# EasyEDA Pro project Ada - V1 as built.eprj

# Schematic Main Board

## Sheets
1 Daughter Cards: Create Date: 2024-01-18; Page Name: Daughter Cards; Project Name: Ada; Schematic Name: Main Board; Update Date: 2024-08-05; Company: EasyEDA.com; Drawed: EasyEDA Pro; Page Size: A4; Part Number: JLCPCB-002; Reviewed: EasyEDA Pro; Version: V0.1
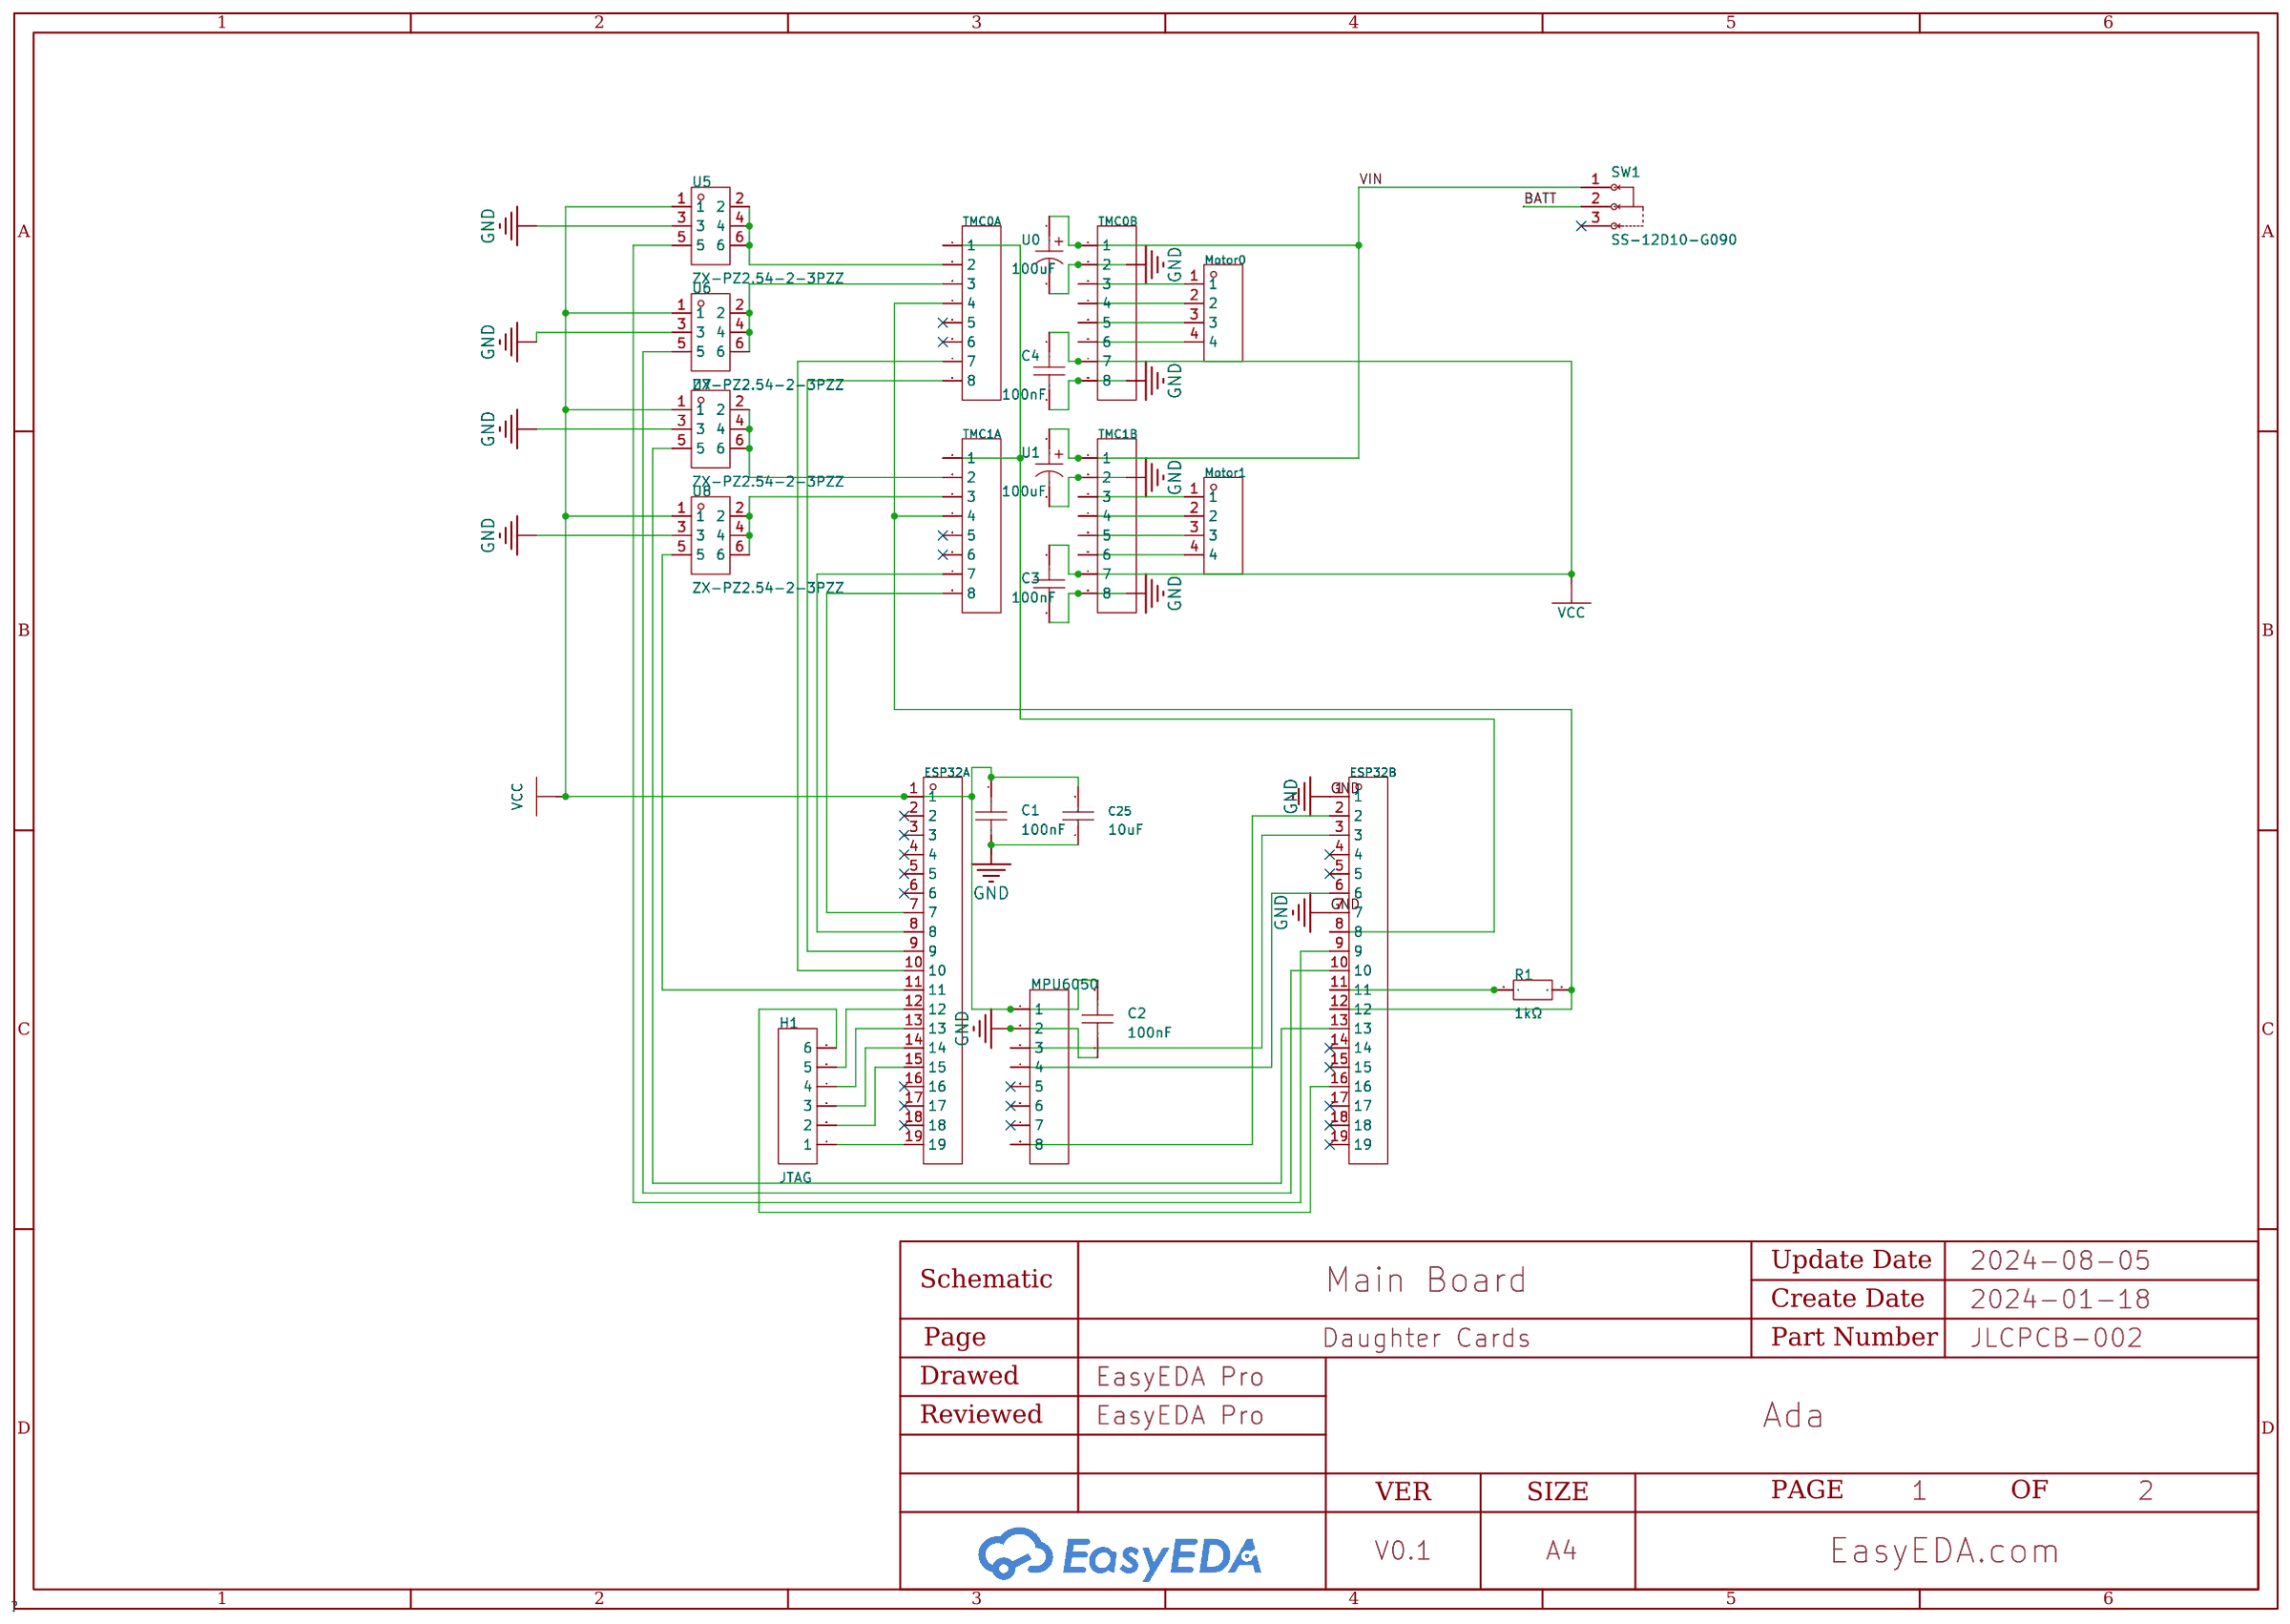
[diagram p0: Daughter Cards]
2 Power Circuit: Create Date: 2024-07-30; Page Name: Power Circuit
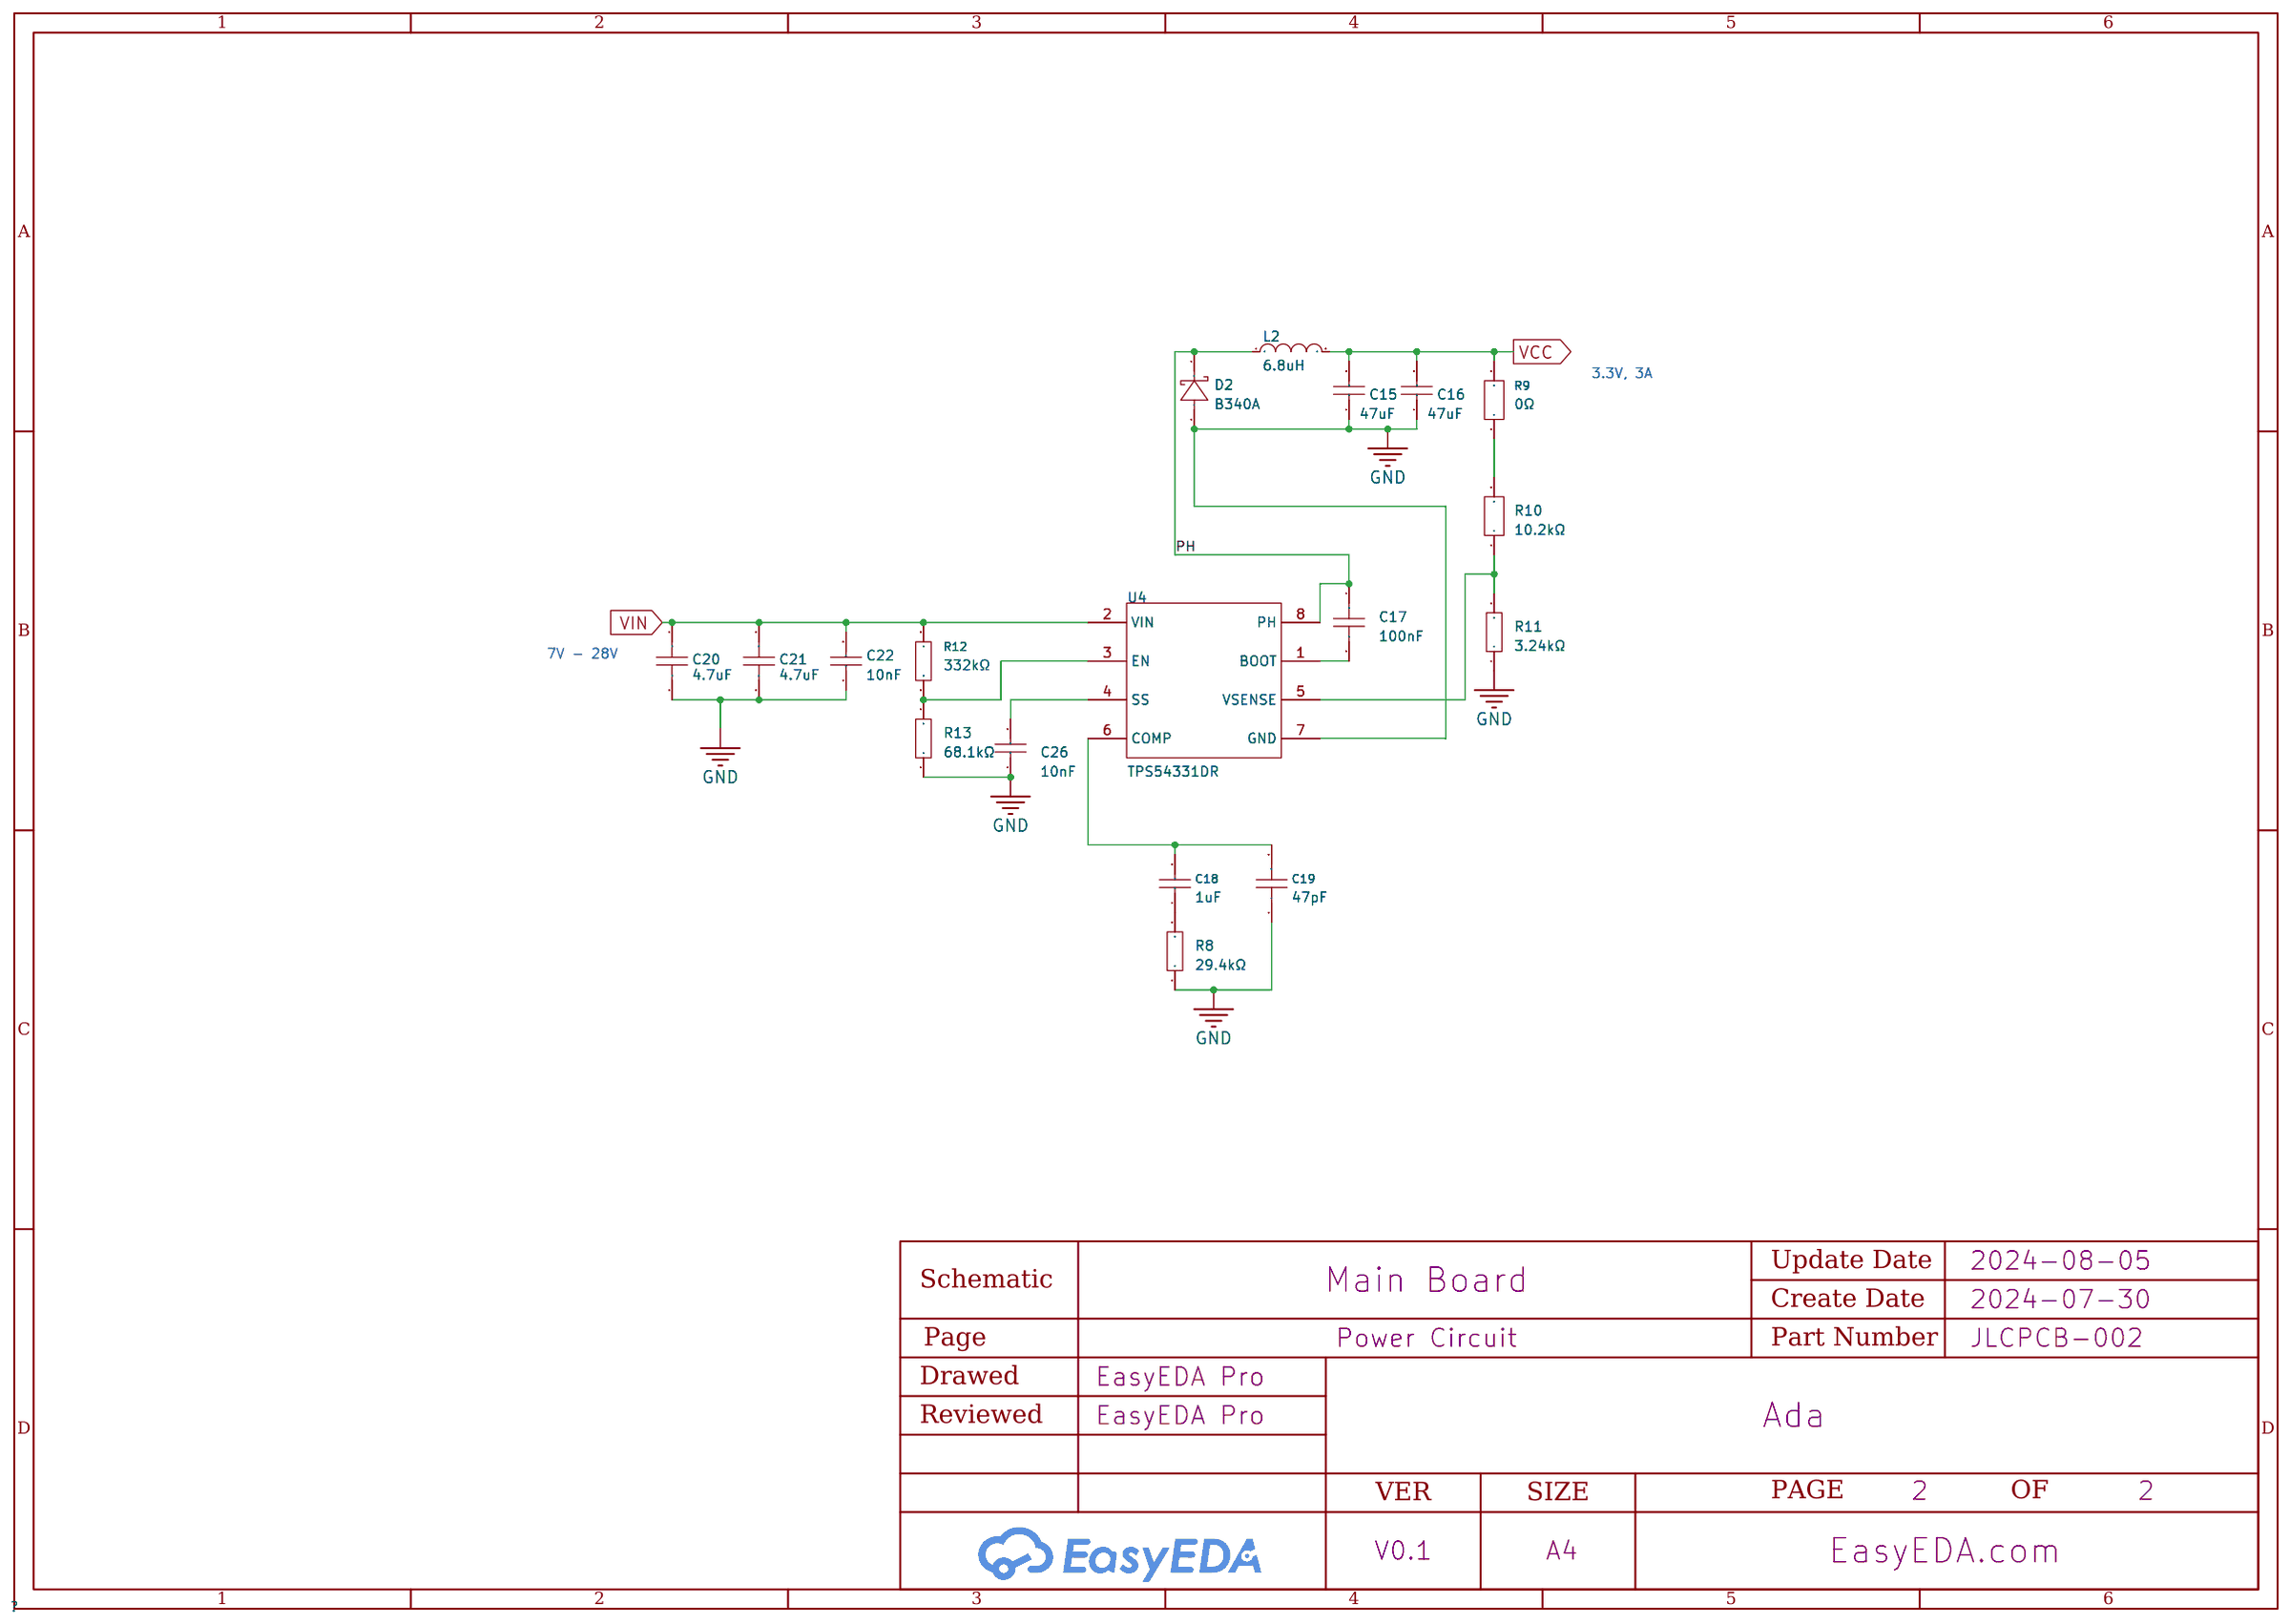
[diagram p1: Power Circuit]

## Parts
sheet Daughter Cards
C1  100nF  [C0201]
C2  100nF  [C0201]
C3  100nF  [C0201]
C4  100nF  [C0201]
C25  10uF  [C0402]
ESP32A  ESP32  [HDR-TH_19P-P2.54-V-F]
ESP32B  2.54-1*19P母  [HDR-TH_19P-P2.54-V-F]
H1  JTAG  [HDR-TH_6P-P2.54-V-M-1]
Motor0  Motor 0  [HDR-TH_4P-P2.54-V-M]
Motor1  Motor 1  [HDR-TH_4P-P2.54-V-M]
MPU6050  MPU6050  [HDR-TH_8P-P2.54-V-F-1]
R1  1kΩ  [R0603]
SW1  SS-12D10-G090  [SW-TH_3P-L12.7-W6.6-P4.70_C9900034369]
TMC0A  TMC0A  [HDR-TH_8P-P2.54-V-F-1]
TMC0B  2.54-1*8P母环保  [HDR-TH_8P-P2.54-V-F-1]
TMC1A  TMC2209  [HDR-TH_8P-P2.54-V-F-1]
TMC1B  2.54-1*8P母环保  [HDR-TH_8P-P2.54-V-F-1]
U0  100uF  [CAP-TH_BD6.3-P2.50-D0.5-FD]
U1  100uF  [CAP-TH_BD6.3-P2.50-D0.5-FD]
U5  ZX-PZ2.54-2-3PZZ  [HDR-TH_6P-P2.54-V-M-R2-C3-S2.54-1]
U6  ZX-PZ2.54-2-3PZZ  [HDR-TH_6P-P2.54-V-M-R2-C3-S2.54-1]
U7  ZX-PZ2.54-2-3PZZ  [HDR-TH_6P-P2.54-V-M-R2-C3-S2.54-1]
U8  ZX-PZ2.54-2-3PZZ  [HDR-TH_6P-P2.54-V-M-R2-C3-S2.54-1]
sheet Power Circuit
C15  47uF  [C0805]
C16  47uF  [C0805]
C17  100nF  [C0201]
C18  1uF  [C0402]
C19  47pF  [C0603]
C20  4.7uF  [C0603]
C21  4.7uF  [C0603]
C22  10nF  [C0603]
C26  10nF  [C0201]
D2  B340A  [SMA_L4.3-W2.6-LS5.0-RD]
L2  6.8uH  [IND-SMD_L5.2-W5.2_MS0530-XX]
R8  29.4kΩ  [R0201]
R9  0Ω  [R0201]
R10  10.2kΩ  [R0201]
R11  3.24kΩ  [R0603]
R12  332kΩ  [R0402]
R13  68.1kΩ  [R0402]
U4  TPS54331DR  [SOIC-8_L5.0-W4.0-P1.27-LS6.0-BL]

## Library data of the parts
C1-C4 C17 = CL03A104KQ3NNNC: Capacitance: Tolerance:±10% Tolerance:±10% Voltage Rated: Temperature Coefficient:; LCSC Part Name: 100nF ±10% 6.3V; Supplier Part: C160831; Manufacturer: SAMSUNG(三星); Supplier Footprint: 0201; Datasheet: https://atta.szlcsc.com/upload/public/pdf/source/20171228/C163510_15144412327381213809.pdf; Supplier: LCSC; Tolerance: ±10%
C25 = CL05A106MQ5NUNC: Capacitance: Tolerance:±20% Tolerance:±20% Voltage Rated: Temperature Coefficient:; LCSC Part Name: 10uF ±20% 6.3V; Supplier Part: C15525; Manufacturer: SAMSUNG(三星); Supplier Footprint: 0402; Datasheet: https://atta.szlcsc.com/upload/public/pdf/source/20220823/2B02EE04F8F211D38A52DCB16EB6BEBA.pdf; Supplier: LCSC; Tolerance: ±20%
ESP32A ESP32B = 2.54-1*19P母: Pitch:2.54mm Row Spacing:- Mounting Type:Straight Number of Rows:Plugin Number of Holes:19P Insulation Height:- Contact Material:- Contact Plating:-; LCSC Part Name: 间距:2.54mm 直插; Supplier Part: C319202; Manufacturer: BOOMELE(博穆精密); Supplier Footprint: 插件,P=2.54mm; JLCPCB Part Class: Extended Part; Supplier: LCSC; Pitch: 2.54mm; Mounting Type: Straight; Number of Rows: Plugin; Number of Holes: 19P
H1 = 2.54-1x6P直针: Pin Structure:1x6P Pitch:2.54mm Row Spacing:- Circluar Pins/Square Pins:Square Pins Mounting Type:Straight Number of Rows:Plugin Number of Pins:6P Current Rating (Max):3A Voltage Rating (Max):- Length of Mating Pin:- Insulation Height:- Contact Material:; LCSC Part Name: 间距:2.54mm 1x6P 直插 方针; Supplier Part: C37208; Manufacturer: BOOMELE(博穆精密); Supplier Footprint: 插件,P=2.54mm; JLCPCB Part Class: Extended Part; Supplier: LCSC; Pin Structure: 1x6P; Pitch: 2.54mm; Circluar Pins/Square Pins: Square Pins; Mounting Type: Straight; Number of Rows: Plugin; Number of Pins: 6P; Current Rating (Max): 3A; Operating Temperature Range: -40℃~+105℃; Color: Black
Motor0 Motor1 = PZ254V-11-04P: Pin Structure:1x4P Pitch:2.54mm Row Spacing:- Circluar Pins/Square Pins:Square Pins Mounting Type:Straight Number of Rows:Plugin Number of Pins:4P Current Rating (Max):3A Voltage Rating (Max):250V Length of Mating Pin:6mm Insulation Height:2.5mm Length of; LCSC Part Name: 间距:2.54mm 1x4P 直插 方针; Supplier Part: C2691448; Manufacturer: XFCN(兴飞); Supplier Footprint: 插件,P=2.54mm; JLCPCB Part Class: Extended Part; Datasheet: https://atta.szlcsc.com/upload/public/pdf/source/20200309/C492403_F9F19131791D08044AD4F84F8E751A34.pdf; Supplier: LCSC; Pin Structure: 1x4P; Pitch: 2.54mm; Circluar Pins/Square Pins: Square Pins; Mounting Type: Straight; Number of Rows: Plugin; Number of Pins: 4P; Current Rating (Max): 3A; Voltage Rating (Max): 250V; Length of Mating Pin: 6mm; Insulation Height: 2.5mm; Length of End Connection Pin: 3mm; Operating Temperature Range: -40℃~+105℃; Color: Black
MPU6050 TMC0A TMC0B TMC1A TMC1B = 2.54-1*8P母环保: Holes Structure:1x8P Pitch:2.54mm Row Spacing:- Mounting Type:Straight Number of Rows:Plugin Number of Holes:8P Insulation Height:- Contact Material:- Contact Plating:-; LCSC Part Name: 间距:2.54mm 1x8P 直插; Supplier Part: C27438; Manufacturer: BOOMELE(博穆精密); Supplier Footprint: 插件,P=2.54mm; JLCPCB Part Class: Extended Part; Datasheet: https://atta.szlcsc.com/upload/public/pdf/source/20231221/1CA800C6799ED97958773716FAA1BFFE.pdf; Supplier: LCSC; Holes Structure: 1x8P; Pitch: 2.54mm; Mounting Type: Straight; Number of Rows: Plugin; Number of Holes: 8P
R1 = FCR0603F1K: Type:Thick Film Resistors Resistance: Tolerance:±1% Tolerance:±1% Power(Watts): Overload Voltage (Max): Operating Temperature Range:-55℃~+155℃ Operating Temperature Range:-55℃~+155℃; LCSC Part Name: 1K ±1%; Supplier Part: C5913168; Manufacturer: VO(翔胜); Supplier Footprint: 0603; Datasheet: https://atta.szlcsc.com/upload/public/pdf/source/20230428/98B65D379E9BA4CF2A9223D1647B01B6.pdf; Supplier: LCSC; Type: Thick Film Resistors; Tolerance: ±1%; Operating Temperature Range: -55℃~+155℃
SW1 = SS-12D10-G090: Circuit:SPDT Pin Style:PCPin Switch Length:12.7mm Switch Width:6.6mm Switch Height:13.4mm Mounting Style:Straight Actuator Color:Black Current Rating (DC):5A Voltage Rating (DC):24V Current Rating (AC):- Voltage Rating (AC):- Mechanical Life:1万次 Operating; LCSC Part Name: 5A大电流拨动开关 G9柄; Supplier Part: C5155552; Manufacturer: G-Switch(品赞); Supplier Footprint: 插件; Datasheet: https://atta.szlcsc.com/upload/public/pdf/source/20240530/FB6A27340729D0C5B76E7AC8CC1F32D2.pdf; Supplier: LCSC; Circuit: SPDT; Pin Style: PCPin; Switch Length: 12.7mm; Switch Width: 6.6mm; Switch Height: 13.4mm; Mounting Style: Straight; Actuator Color: Black; Current Rating (DC): 5A; Voltage Rating (DC): 24V; Mechanical Life: 1万次; Operating Temperature: -25℃~+70℃
U0 U1 = 03EC0728: Capacitance: Tolerance:±20% Tolerance:±20% Rated Voltage: Ripple Current:140mA@120kHz Equivalent Series Resistance(ESR):- Lead Spacing: φD: L: Lifetime @ Temp:2000hrs@105℃ Operating Temperature:-40℃~+105℃ Operating Temperature:-40℃~+105℃; LCSC Part Name: 100uF ±20% 25V; Supplier Part: C2831782; Manufacturer: KNSCHA(科尼盛); Supplier Footprint: 插件,D6.3xL12mm; Datasheet: https://atta.szlcsc.com/upload/public/pdf/source/20210511/C2831782_5BCB0B9CD26517435D205DF95E3C4F67.pdf; Supplier: LCSC; Tolerance: ±20%; Ripple Current: 140mA@120kHz; Lifetime @ Temp: 2000hrs@105℃; Operating Temperature: -40℃~+105℃
U5-U8 = ZX-PZ2.54-2-3PZZ: Pin Structure:2x3P Pitch:2.54mm Row Spacing:2.54mm Circluar Pins/Square Pins:Square Pins Mounting Type:Straight Number of Rows:双排 Number of Pins:6P Current Rating (Max):3A Voltage Rating (Max):1kV Length of Mating Pin:6mm Insulation Height:2.5mm Length of; LCSC Part Name: 2x3P 间距:2.54mm 方针 直插; Supplier Part: C7501274; Manufacturer: Megastar(兆星); Supplier Footprint: 插件,P=2.54mm; Datasheet: https://atta.szlcsc.com/upload/public/pdf/source/20231122/E8390501A702A71E626C593F036B3607.pdf; Supplier: LCSC; Pin Structure: 2x3P; Pitch: 2.54mm; Row Spacing: 2.54mm; Circluar Pins/Square Pins: Square Pins; Mounting Type: Straight; Number of Rows: 双排; Number of Pins: 6P; Current Rating (Max): 3A; Voltage Rating (Max): 1kV; Length of Mating Pin: 6mm; Insulation Height: 2.5mm; Length of End Connection Pin: 3mm; Contact Plating: Gold; Operating Temperature Range: -40℃~+105℃; Color: Black
C15 C16 = CL21A476MQYNNNE: Capacitance: Tolerance:±20% Tolerance:±20% Voltage Rated: Temperature Coefficient:; LCSC Part Name: 47uF ±20% 6.3V; Supplier Part: C16780; Manufacturer: SAMSUNG(三星); Supplier Footprint: 0805; Datasheet: https://atta.szlcsc.com/upload/public/pdf/source/20160218/1457707763339.pdf; Supplier: LCSC; Tolerance: ±20%
C18 = CL05A105KQ5NNNC: Capacitance: Tolerance:±10% Tolerance:±10% Voltage Rated: Temperature Coefficient:; LCSC Part Name: 1uF ±10% 6.3V; Supplier Part: C107372; Manufacturer: SAMSUNG(三星); Supplier Footprint: 0402; Datasheet: https://atta.szlcsc.com/upload/public/pdf/source/20160218/1457707763339.pdf; Supplier: LCSC; Tolerance: ±10%
C19 = CC0603JRNPO8BN470: Capacitance: Tolerance:±5% Tolerance:±5% Voltage Rated: Temperature Coefficient:; LCSC Part Name: 47pF ±5% 25V; Supplier Part: C519392; Manufacturer: YAGEO(国巨); Supplier Footprint: 0603; Datasheet: https://atta.szlcsc.com/upload/public/pdf/source/20200423/C519392_865C256CEF0C45ADD797D116E7ADE01D.pdf; Supplier: LCSC; Tolerance: ±5%
C20 C21 = CL10A475KL8NRNC: Capacitance: Tolerance:±10% Tolerance:±10% Voltage Rated: Temperature Coefficient:; LCSC Part Name: 4.7uF ±10% 35V; Supplier Part: C307467; Manufacturer: SAMSUNG(三星); Supplier Footprint: 0603; JLCPCB Part Class: Extended Part; Datasheet: https://atta.szlcsc.com/upload/public/pdf/source/20160218/1457707763339.pdf; Supplier: LCSC; Tolerance: ±10%
C22 = CL10B103KB8NNNC: Capacitance: Tolerance:±10% Tolerance:±10% Voltage Rated: Temperature Coefficient:; LCSC Part Name: 10nF ±10% 50V; Supplier Part: C1589; Manufacturer: SAMSUNG(三星); Supplier Footprint: 0603; JLCPCB Part Class: Extended Part; Datasheet: https://atta.szlcsc.com/upload/public/pdf/source/20160218/1457707763339.pdf; Supplier: LCSC; Tolerance: ±10%
C26 = GRM033R70J103KA01D: Capacitance: Tolerance:±10% Tolerance:±10% Voltage Rated: Temperature Coefficient:; LCSC Part Name: 10nF ±10% 6.3V; Supplier Part: C76940; Manufacturer: muRata(村田); Supplier Footprint: 0201; Datasheet: https://atta.szlcsc.com/upload/public/pdf/source/20180307/C76940_15204091030811407728.pdf; Supplier: LCSC; Tolerance: ±10%
D2 = B340A_C3018525: Forward Voltage (Vf@If):550mV@3A Reverse Voltage (Vr):40V Average Rectified Current (Io):3A Reverse Leakage Current (Ir):500uA@40V; LCSC Part Name: 电压:40V 电流:3A; Supplier Part: C3018525; Manufacturer: FUXINSEMI(富芯森美); Supplier Footprint: SMA(DO-214AC); Datasheet: https://atta.szlcsc.com/upload/public/pdf/source/20220530/48889337C27311960E6F9D350CFD44EF.pdf; Supplier: LCSC; Forward Voltage (Vf@If): 550mV@3A; Reverse Voltage (Vr): 40V; Average Rectified Current (Io): 3A; Reverse Leakage Current (Ir): 500uA@40V
L2 = MDA5030-6R8M: Inductance: Tolerance:±20% Tolerance:±20% Rated Current: Saturation Current (Isat): DC Resistance (DCR):; LCSC Part Name: 6.8uH ±20% 3.5A; Supplier Part: C2847478; Manufacturer: KOHERelec(科或); Supplier Footprint: SMD,5.2x5.7mm; Datasheet: https://atta.szlcsc.com/upload/public/pdf/source/20210806/C2847475_BCA7949AA3147D213A746F6BA524684A.pdf; Supplier: LCSC; Tolerance: ±20%
R8 = RC-01W2942FT: Type:Thick Film Resistors Resistance:29.4kΩ Tolerance:±1% Tolerance:±1% Power(Watts): Overload Voltage (Max): Temperature Coefficient:±200ppm/℃ Temperature Coefficient:±200ppm/℃ Operating Temperature Range:-55℃~+125℃ Operating Temperature Range:-55℃~+125℃; LCSC Part Name: 厚膜电阻 29.4kΩ ±1% 50mW; Supplier Part: C320810; Manufacturer: FH(风华); Supplier Footprint: 0201; Datasheet: https://atta.szlcsc.com/upload/public/pdf/source/20190117/C304933_DE23167EE8A6EA4261B120B384E5FCE3.pdf; Supplier: LCSC; Type: Thick Film Resistors; Tolerance: ±1%; Temperature Coefficient: ±200ppm/℃; Operating Temperature Range: -55℃~+125℃
R9 = 0201WMF0000TEE: Type:Thick Film Resistors Resistance: Tolerance:±1% Tolerance:±1% Power(Watts): Overload Voltage (Max): Operating Temperature Range:-55℃~+155℃ Operating Temperature Range:-55℃~+155℃; LCSC Part Name: 0Ω ±1% 50mW 厚膜电阻; Supplier Part: C473473; Manufacturer: UNI-ROYAL(厚声); Supplier Footprint: 0201; Datasheet: https://atta.szlcsc.com/upload/public/pdf/source/20200306/C422600_1E6D84923E4A46A82E41ADD87F860B5C.pdf; Supplier: LCSC; Type: Thick Film Resistors; Tolerance: ±1%; Operating Temperature Range: -55℃~+155℃
R10 = RTT011022FTH: Type:Thick Film Resistors Resistance: Tolerance:±1% Tolerance:±1% Power(Watts): Overload Voltage (Max): Temperature Coefficient:±200ppm/℃ Temperature Coefficient:±200ppm/℃ Operating Temperature Range:-55℃~+125℃ Operating Temperature Range:-55℃~+125℃; LCSC Part Name: 厚膜电阻 10.2kΩ ±1% 50mW; Supplier Part: C166388; Manufacturer: RALEC(旺诠); Supplier Footprint: 0201; Datasheet: https://atta.szlcsc.com/upload/public/pdf/source/20180928/C303758_52AE496EA05AD4D633595C32F5A0EBAF.pdf; Supplier: LCSC; Type: Thick Film Resistors; Tolerance: ±1%; Temperature Coefficient: ±200ppm/℃; Operating Temperature Range: -55℃~+125℃
R11 = 0603WAF3241T5E: Type:Thick Film Resistors Resistance:3.24kΩ Tolerance:±1% Tolerance:±1% Power(Watts): Overload Voltage (Max): Temperature Coefficient:±100ppm/℃ Temperature Coefficient:±100ppm/℃ Operating Temperature Range:-55℃~+155℃ Operating Temperature Range:-55℃~+155℃; LCSC Part Name: 3.24kΩ ±1% 100mW 厚膜电阻; Supplier Part: C22994; Manufacturer: UNI-ROYAL(厚声); Supplier Footprint: 0603; Datasheet: https://atta.szlcsc.com/upload/public/pdf/source/20200306/C422600_1E6D84923E4A46A82E41ADD87F860B5C.pdf; Supplier: LCSC; Type: Thick Film Resistors; Tolerance: ±1%; Temperature Coefficient: ±100ppm/℃; Operating Temperature Range: -55℃~+155℃
R12 = 0402WGF3323TCE: Type:Thick Film Resistors Resistance:332kΩ Tolerance:±1% Tolerance:±1% Power(Watts): Overload Voltage (Max): Temperature Coefficient:±100ppm/℃ Temperature Coefficient:±100ppm/℃ Operating Temperature Range:-55℃~+155℃ Operating Temperature Range:-55℃~+155℃; LCSC Part Name: 332kΩ ±1% 62.5mW 厚膜电阻; Supplier Part: C44358; Manufacturer: UNI-ROYAL(厚声); Supplier Footprint: 0402; JLCPCB Part Class: Extended Part; Datasheet: https://atta.szlcsc.com/upload/public/pdf/source/20200306/C422600_1E6D84923E4A46A82E41ADD87F860B5C.pdf; Supplier: LCSC; Type: Thick Film Resistors; Tolerance: ±1%; Temperature Coefficient: ±100ppm/℃; Operating Temperature Range: -55℃~+155℃
R13 = AC0402FR-0768K1L: Type:Thick Film Resistors Resistance: Tolerance:±1% Tolerance:±1% Power(Watts): Overload Voltage (Max): Temperature Coefficient:±100ppm/℃ Temperature Coefficient:±100ppm/℃ Operating Temperature Range:-55℃~+155℃ Operating Temperature Range:-55℃~+155℃; LCSC Part Name: 厚膜电阻 68.1kΩ ±1% 62.5mW; Supplier Part: C227190; Manufacturer: YAGEO(国巨); Supplier Footprint: 0402; JLCPCB Part Class: Extended Part; Datasheet: https://atta.szlcsc.com/upload/public/pdf/source/20180927/C229861_4ABDC471507C1ED6AFB4BA66AFC8620A.pdf; Supplier: LCSC; Type: Thick Film Resistors; Tolerance: ±1%; Temperature Coefficient: ±100ppm/℃; Operating Temperature Range: -55℃~+155℃
U4 = TPS54331DR: Function:Step-down type Output Type:Adjustable Input Voltage:3.5V~28V Input Voltage:3.5V~28V Output Voltage:800mV~25V Output Voltage:800mV~25V Output Current (Max):3A Switching Frequency:570kHz Operating Temperature:-40℃~+150℃@(TJ) Operating Temperature:-; Supplier Part: C9865; Manufacturer: TI(德州仪器); Supplier Footprint: SOIC-8; Datasheet: https://www.ti.com/cn/lit/gpn/tps54331; Supplier: LCSC; Function: Step-down type; Output Type: Adjustable; Input Voltage: 3.5V~28V; Output Voltage: 800mV~25V; Output Current (Max): 3A; Switching Frequency: 570kHz; Operating Temperature: -40℃~+150℃@(TJ); Synchronous Rectification: NO; Number of Outputs: 1; Topology: Step-down; Switch tube (built-in/external): 内置

## Nets
GND: C1.2 C2.2 C3.2 C4.2 C15.1 C16.1 C19.1 C20.2 C21.2 C22.1 C25.1 C26.1 D2.2(A) ESP32B.1 ESP32B.7 MPU6050.2 R8.1 R11.1 R13.1 TMC0B.2 TMC0B.8 TMC1B.2 TMC1B.8 U0.2 U1.2 U4.7(GND) U5.3 U6.3 U7.3 U8.3
VCC: C1.1 C2.1 C3.1 C4.1 C15.2 C16.2 C25.2 ESP32A.1 L2.2 MPU6050.1 R9.2 TMC0B.7 TMC1B.7 U5.1 U6.1 U7.1 U8.1
VIN: C20.1 C21.1 C22.2 R12.2 SW1.1 TMC0B.1 TMC1B.1 U0.1 U1.1 U4.2(VIN)
BATT: SW1.2
PH: C17.1 D2.1(K) L2.1 U4.8(PH)
$1N2122: ESP32B.8 TMC0A.1 TMC1A.1
$1N2154: Motor1.1 TMC1B.3
$1N2157: Motor1.2 TMC1B.4
$1N2160: Motor1.3 TMC1B.5
$1N2163: Motor1.4 TMC1B.6
$1N2166: Motor0.1 TMC0B.3
$1N2169: Motor0.2 TMC0B.4
$1N2172: Motor0.3 TMC0B.5
$1N2175: Motor0.4 TMC0B.6
$1N2308: ESP32A.7 TMC1A.8
$1N2313: ESP32A.8 TMC1A.7
$1N2318: ESP32A.9 TMC0A.8
$1N2328: ESP32A.10 TMC0A.7
$1N2522: ESP32B.11 R1.1
$1N2539: ESP32B.12 R1.2 TMC0A.4 TMC1A.4
$1N9917: TMC0A.2 U5.2 U5.4 U5.6
$1N9931: TMC0A.3 U6.2 U6.4 U6.6
$1N9989: TMC1A.2 U7.2 U7.4 U7.6
$1N10004: TMC1A.3 U8.2 U8.4 U8.6
$1N11023: ESP32A.19 H1.1
$1N11068: ESP32A.13 H1.4
$1N11073: ESP32A.14 H1.3
$1N11078: ESP32A.15 H1.2
$1N15354: ESP32A.11 U8.5
$1N15455: ESP32B.13 U7.5
$1N15484: ESP32A.12 H1.5
$1N15612: ESP32B.16 H1.6
$1N15620: ESP32B.9 U5.5
$1N15633: ESP32B.10 U6.5
$2N758: C26.2 U4.4(SS)
$2N763: C17.2 U4.1(BOOT)
$2N764: C18.2 C19.2 U4.6(COMP)
$2N769: R12.1 R13.2 U4.3(EN)
$2N774: C18.1 R8.2
$2N775: R9.1 R10.2
$2N777: R10.1 R11.2 U4.5(VSENSE)
Net-(ESP32B-2): ESP32B.2 MPU6050.8
Net-(ESP32B-3): ESP32B.3 MPU6050.3
Net-(ESP32B-6): ESP32B.6 MPU6050.4

Not connected (* = marked no-connect by the designer): ESP32A 2* 3* 4* 5* 6* 16* 17* 18*; ESP32B 4* 5* 14* 15* 17* 18* 19*; MPU6050 5* 6* 7*; SW1 3*; TMC0A 5* 6*; TMC1A 5* 6*

## Notes on the sheets
sheet 2
- 3.3V, 3A
- 7V - 28V

# Board PCB1
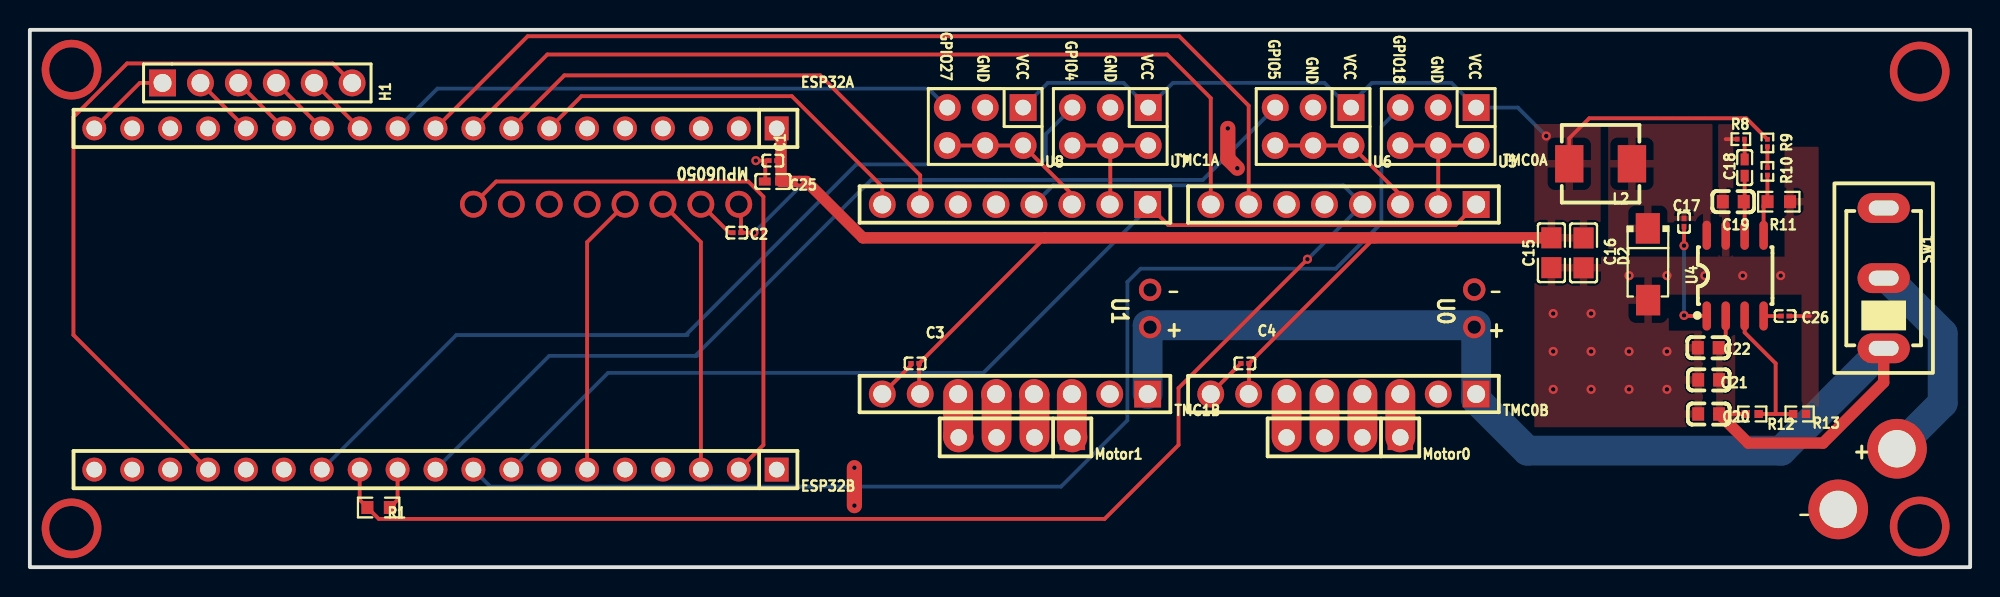
[diagram p2: board, top side]
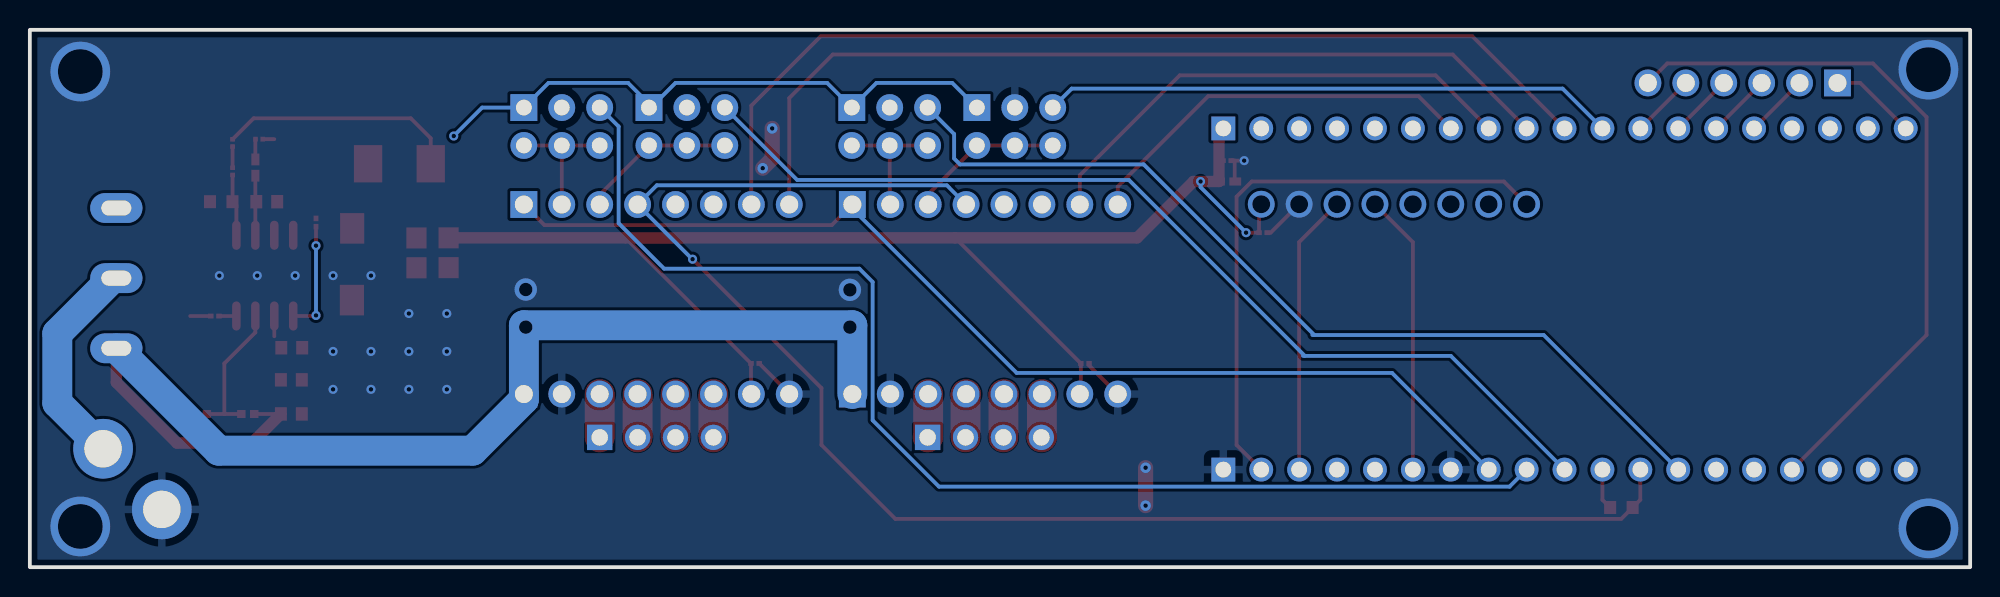
[diagram p3: board, bottom side, seen from below]

Outline 130 x 36 mm; copper layers: Top Layer, Bottom Layer. Coordinates in mm from the lower left corner of the outline.
Outline path: rectangle 0,36 130,0
Stack: Top Layer 0.035mm / Dielectric1 1.51mm FR4 er 4.5 / Bottom Layer 0.035mm

## Design rules (mm)
template: JLCPCB Capability(Two Layers Board)
spacing copperThickness1oz (default): track to track 0.102, other pairs 0.152 to 0.3
spacing copperThickness2oz: track to track 0.203, other pairs 0.152 to 0.3
track width copperThickness1oz (default): min 0.127, default 0.254, max 2.54
track width copperThickness2oz: min 0.203, default 0.254, max 2.54
differential pair differentialPair (default): width min 0.127, default 0.254, max 2.54; gap min 0.152, default 0.152
via viaSize (default): diameter min 0.5, default 0.61, max 10; hole min 0.3, default 0.305, max 6.3

## Placement (name value [footprint] x y rotation side)
C1  100nF  [C0201]  49.78 27.24 180 top
C2  100nF  [C0201]  47.37 22.41 180 top
C3  100nF  [C0201]  59.31 13.65 180 top
C4  100nF  [C0201]  81.41 13.65 180 top
C15  47uF  [C0805]  101.95 21.06 90 top
C16  47uF  [C0805]  104.1 21.06 90 top
C17  100nF  [C0201]  110.83 23.09 270 top
C18  1uF  [C0402]  114.89 26.77 270 top
C19  47pF  [C0603]  114.13 24.49 0 top
C20  4.7uF  [C0603]  112.48 10.26 180 top
C21  4.7uF  [C0603]  112.48 12.55 180 top
C22  10nF  [C0603]  112.45 14.7 0 top
C25  10uF  [C0402]  49.78 25.84 0 top
C26  10nF  [C0201]  117.6 16.82 180 top
D2  B340A  [SMA_L4.3-W2.6-LS5.0-RD]  108.42 20.3 270 top
ESP32A  ESP32  [HDR-TH_19P-P2.54-V-F]  27.18 29.4 180 top
ESP32B  2.54-1*19P母  [HDR-TH_19P-P2.54-V-F]  27.18 6.54 180 top
H1  JTAG  [HDR-TH_6P-P2.54-V-M-1]  15.24 32.44 0 top
L2  6.8uH  [IND-SMD_L5.2-W5.2_MS0530-XX]  105.24 27.03 180 top
Motor0  Motor 0  [HDR-TH_4P-P2.54-V-M]  88.01 8.7 180 top
Motor1  Motor 1  [HDR-TH_4P-P2.54-V-M]  66.04 8.7 180 top
NOREF  -  [Pad_e82547]  125.09 7.93 0 top
NOREF#2  -  [Pad_e82557]  121.16 3.87 0 top
R1  1kΩ  [R0603]  23.37 4 180 top
R8  29.4kΩ  [R0201]  114.64 28.68 0 top
R9  0Ω  [R0201]  116.42 28.42 90 top
R10  10.2kΩ  [R0201]  116.42 26.52 90 top
R11  3.24kΩ  [R0603]  117.18 24.49 180 top
R12  332kΩ  [R0402]  115.4 10.26 180 top
R13  68.1kΩ  [R0402]  118.58 10.26 180 top
SW1  SS-12D10-G090  [SW-TH_3P-L12.7-W6.6-P4.70_C9900034369]  124.21 19.36 90 top
TMC0A  TMC0A  [HDR-TH_8P-P2.54-V-F-1]  88.01 24.3 180 top
TMC0B  2.54-1*8P母环保  [HDR-TH_8P-P2.54-V-F-1]  88.01 11.6 180 top
TMC1A  TMC2209  [HDR-TH_8P-P2.54-V-F-1]  66 24.3 180 top
TMC1B  2.54-1*8P母环保  [HDR-TH_8P-P2.54-V-F-1]  66 11.6 180 top
U4  TPS54331DR  [SOIC-8_L5.0-W4.0-P1.27-LS6.0-BL]  114.26 19.53 0 top
U5  ZX-PZ2.54-2-3PZZ  [HDR-TH_6P-P2.54-V-M-R2-C3-S2.54-1]  94.36 29.52 180 top
U6  ZX-PZ2.54-2-3PZZ  [HDR-TH_6P-P2.54-V-M-R2-C3-S2.54-1]  85.98 29.52 180 top
U7  ZX-PZ2.54-2-3PZZ  [HDR-TH_6P-P2.54-V-M-R2-C3-S2.54-1]  72.39 29.52 180 top
U8  ZX-PZ2.54-2-3PZZ  [HDR-TH_6P-P2.54-V-M-R2-C3-S2.54-1]  64.01 29.52 180 top

## Footprints (pads in the part's own frame, mm; a bottom-side part is the same pattern mirrored in y, then rotated)
C0201
  rect 0.368x0.324 smd: 1(-0.275,0) 2(0.275,0)
C0402
  rect 0.79x0.54 smd: 1(-0.545,0) 2(0.545,0)
C0603
  rect 0.8x0.9 smd: 1(-0.7,0) 2(0.7,0)
C0805
  rect 1.41x1.35 smd: 1(-1,0) 2(1,0)
HDR-TH_4P-P2.54-V-M
  rect 1.7x1.7 hole 1.1: 1(-3.81,0)
  round 1.7 hole 1.1: 2(-1.27,0) 3(1.27,0) 4(3.81,0)
HDR-TH_6P-P2.54-V-M-1
  rect 1.8x1.8 hole 1.2: 1(-6.35,0)
  round 1.8 hole 1.2: 2(-3.81,0) 3(-1.27,0) 4(1.27,0) 5(3.81,0) 6(6.35,0)
HDR-TH_6P-P2.54-V-M-R2-C3-S2.54-1
  rect 1.8x1.8 hole 1.05: 1(-2.54,-1.27)
  round 1.8 hole 1.05: 2(-2.54,1.27) 3(0,-1.27) 4(0,1.27) 5(2.54,-1.27) 6(2.54,1.27)
HDR-TH_8P-P2.54-V-F-1
  rect 1.8x1.8 hole 1.2: 1(-8.89,0)
  round 1.8 hole 1.2: 2(-6.35,0) 3(-3.81,0) 4(-1.27,0) 5(1.27,0) 6(3.81,0) 7(6.35,0) 8(8.89,0)
HDR-TH_19P-P2.54-V-F
  rect 1.6x1.6 hole 1.05: 1(-22.86,0)
  round 1.6 hole 1.05: 2(-20.32,0) 3(-17.78,0) 4(-15.24,0) 5(-12.7,0) 6(-10.16,0) 7(-7.62,0) 8(-5.08,0) 9(-2.54,0) 10(0,0) 11(2.54,0) 12(5.08,0) 13(7.62,0) 14(10.16,0) 15(12.7,0) 16(15.24,0) 17(17.78,0) 18(20.32,0) 19(22.86,0)
IND-SMD_L5.2-W5.2_MS0530-XX
  rect 1.9x2.5 smd: 1(-2.1,0) 2(2.1,0)
Pad_e82547
  round 4 hole 2.5: BATT(0,0)
Pad_e82557
  round 4 hole 2.5: BATT(0,0)
R0201
  rect 0.303x0.324 smd: 1(-0.241,0) 2(0.241,0)
R0402
  rect 0.566x0.54 smd: 1(-0.433,0) 2(0.433,0)
R0603
  rect 0.806x0.864 smd: 1(-0.753,0) 2(0.753,0)
SMA_L4.3-W2.6-LS5.0-RD
  rect 2.046x1.62 smd: 1(-2.404,-0.009) 2(2.404,0.009)
SOIC-8_L5.0-W4.0-P1.27-LS6.0-BL
  oval 0.569x1.95 smd: 1(-1.905,-2.705) 2(-0.635,-2.705) 3(0.635,-2.705) 4(1.905,-2.705) 5(1.905,2.705) 6(0.635,2.705) 7(-0.635,2.705) 8(-1.905,2.705)
SW-TH_3P-L12.7-W6.6-P4.70_C9900034369
  oval 2x3.5 hole 1x2: 1(-4.7,0) 2(0,0) 3(4.7,0)

## Nets
As in the schematic, except:
GND: C1.2 C2.2 C3.2 C4.2 C15.1 C16.1 C19.1 C20.2 C21.2 C22.1 C25.1 C26.1 D2.2 ESP32B.1 ESP32B.7 NOREF#2.BATT R8.1 R11.1 R13.1 TMC0B.2 TMC0B.8 TMC1B.2 TMC1B.8 U4.7 U5.3 U6.3 U7.3 U8.3
BATT: NOREF.BATT SW1.2

Pads without a net: ESP32A 2 3 4 5 6 16 17 18; ESP32B 4 5 14 15 17 18 19; SW1 3; TMC0A 5 6; TMC1A 5 6

## Via types
v1: diameter 0.61, hole 0.304, Top Layer to Bottom Layer, 15 vias
v2: diameter 4, hole 3, Top Layer to Bottom Layer, 4 vias
v3: diameter 1.5, hole 0.9, Top Layer to Bottom Layer, 4 vias
v4: diameter 0.71, hole 0.305, Top Layer to Bottom Layer, 4 vias
v5: diameter 0.61, hole 0.305, Top Layer to Bottom Layer, 7 vias
v6: diameter 1.8, hole 1.2, Top Layer to Bottom Layer, 8 vias

## Routing (per net, layer and track width the routed paths; a pad name or vN(x,y) marks a point on that pad's centre or on a via; arc(x,y) is an arc through that point)
GND: length 18.5
  Top Layer w0.254: C4.2 79.12,11.64 TMC0B.8 ; 49.28,27.24 v5(48.64,27.24) ; 49.28,27.24 49.28,25.92 ; 49.28,27.24 C1.2 ; TMC1B.8 59.03,13.52 C3.2 ; C26.1 119.25,16.82 ; v6(44.96,24.32) 46.86,22.41 C2.2 ; R8.1 113.62,28.68
  Top Layer w1.016: v4(55.24,6.66) v4(55.24,4.12) ; v4(80.9,26.73) 80.26,27.36 v4(80.26,29.4)
  vias: v1(102.06,16.99) v1(102.06,14.45) v1(102.06,11.91) v1(104.61,16.99) v1(104.61,14.45) v1(104.61,11.91) v1(107.14,19.53) v1(107.14,14.45) v1(107.14,11.91) v1(109.68,19.53) v1(109.68,14.45) v1(109.68,11.91) v1(112.22,19.53) v1(114.77,19.53) v1(117.3,19.53) v2(2.79,33.33) v2(2.79,2.6) v2(126.62,33.21) v2(126.62,2.73) v3(75.06,18.58) v3(96.77,18.6)
VCC: length 148.5
  Top Layer w0.254: R9.2 115.01,30.07 104.48,30.07 103.14,28.74 L2.2 ; 90.1,22.06 C4.1 81.68,11.62 TMC0B.7 ; v5(48.51,22.41) C2.1 47.65,24.17 v6(47.5,24.32) ; TMC1B.7 59.58,11.67 C3.1 68,22.06
  Top Layer w0.76: ESP32A.1 50.33,29.11 C25.2 v5(51.56,25.84) 52.04,25.84 55.81,22.06 C15.2
  Bottom Layer w0.254: U8.1 68.2,32.44 73.28,32.44 U7.1 ; U7.1 74.8,30.79 ; U7.1 76.58,32.44 86.74,32.44 88.27,30.92 ; U7.1 75.06,30.79 ; U6.1 88.52,31.05 89.92,32.44 95.25,32.44 U5.1 99.7,30.79 v5(101.6,28.89) ; v5(48.51,22.41) 51.56,25.46 v5(51.56,25.84)
VIN: length 82.1
  Top Layer w0.254: U4.2 113.62,15.47 ; C20.1 R12.2
  Top Layer w0.76: C20.1 115.13,8.31 120.14,8.31 124.21,12.38 SW1.1
  Bottom Layer w2: SW1.1 117.35,7.81 100.33,7.81 96.9,11.23 96.9,16.21 74.89,16.21 TMC1B.1
  vias: v3(75.06,16.08) v3(96.77,16.08)
BATT: length 14.5
  Bottom Layer w2: NOREF.BATT 128.16,11 128.16,15.66 124.46,19.36 SW1.2
$1N1921:
  vias: v6(32.26,24.32)
$1N1932:
  vias: v6(34.8,24.32)
$1N1947:
  vias: v6(37.34,24.32)
$1N2122: length 73.3
  Top Layer w0.254: TMC1A.1 76.27,22.92 95.52,22.92 96.9,24.3
  Bottom Layer w0.254: ESP32B.8 38.73,13.01 63.88,13.01 74.89,24.03 TMC1A.1
$1N2154: length 2.9
  Top Layer w2: TMC1B.3 69.81,8.73 Motor1.1
$1N2157: length 2.9
  Top Layer w2: Motor1.2 67.31,11.56 TMC1B.4
$1N2160: length 2.9
  Top Layer w2: Motor1.3 64.77,11.56 TMC1B.5
$1N2163: length 2.9
  Top Layer w2: TMC1B.6 62.19,8.73 Motor1.4
$1N2166: length 2.9
  Top Layer w2: TMC0B.3 Motor0.1
$1N2169: length 2.9
  Top Layer w2: TMC0B.4 Motor0.2
$1N2172: length 2.9
  Top Layer w2: 86.74,11.6 86.74,8.7
$1N2175: length 2.9
  Top Layer w2: 84.2,11.6 84.2,8.7
$1N2308: length 26.9
  Top Layer w0.254: ESP32A.7 36.96,31.56 51.05,31.56 57.11,25.5 TMC1A.8
$1N2313: length 33.6
  Top Layer w0.254: ESP32A.8 35.81,32.95 52.96,32.95 59.65,26.26 TMC1A.7
$1N2318: length 59.8
  Top Layer w0.254: ESP32A.9 34.67,34.35 76.2,34.35 79.12,31.43 TMC0A.8
$1N2328: length 65.6
  Top Layer w0.254: ESP32A.10 33.36,35.57 77.01,35.57 81.66,30.92 TMC0A.7
$1N2522: length 2.8
  Top Layer w0.254: R1.1 24.64,4.51 ESP32B.11
$1N2539: length 103.8
  Top Layer w0.254: v5(85.6,20.63) 76.96,12 76.96,8.19 72.01,3.23 23.38,3.23 R1.2 22.1,4.51 ESP32B.12
  Bottom Layer w0.254: v5(85.6,20.63) 85.62,20.63 TMC0A.4 87.99,25.59 68.56,25.59 TMC1A.4
$1N9917: length 9
  Top Layer w0.254: 94.36,24.3 U5.4 ; U5.4 U5.2 ; U5.4 U5.6
$1N9931: length 10.4
  Top Layer w0.254: U6.6 U6.4 U6.2 91.82,24.95 TMC0A.3
$1N9989: length 8.9
  Top Layer w0.254: U7.4 72.39,24.33 TMC1A.2 ; U7.4 74.53,28.25 74.73,28.06 ; U7.4 U7.6
$1N10004: length 10.4
  Top Layer w0.254: TMC1A.3 69.81,24.99 U8.2 U8.4 U8.6
$1N11023: length 5.8
  Top Layer w0.254: H1.1 7.37,32.44 ESP32A.19
$1N11068: length 4.3
  Top Layer w0.254: H1.4 ESP32A.13
$1N11073: length 4.3
  Top Layer w0.254: H1.3 ESP32A.14
$1N11078: length 4.3
  Top Layer w0.254: H1.2 ESP32A.15
$1N13375: length 39.5
  Top Layer w0.254: ESP32B.2 49.15,8.19 49.15,24.82 48.13,25.84 31.24,25.84 v6(29.72,24.32)
$1N13569: length 18.8
  Top Layer w0.254: ESP32B.6 37.34,21.78 v6(39.88,24.32)
$1N13578: length 18.8
  Top Layer w0.254: ESP32B.3 44.96,21.78 v6(42.42,24.32)
$1N15354: length 38.5
  Bottom Layer w0.254: U8.5 60.2,32.06 27.3,32.06 ESP32A.11
$1N15455: length 61.4
  Bottom Layer w0.254: ESP32B.13 28.57,15.55 43.94,15.55 ; 43.94,15.55 55.37,26.98 67.68,26.98 68.07,27.38 68.07,29.02 U7.5 ; 43.94,15.55 44.07,15.55
$1N15484: length 4.4
  Top Layer w0.254: ESP32A.12 H1.5 19.05,32.57
$1N15612: length 48.1
  Top Layer w0.254: H1.6 21.59,32.45 20.29,33.75 6.51,33.75 2.92,30.16 2.92,15.55 ESP32B.16
$1N15620: length 82.3
  Bottom Layer w0.254: ESP32B.9 30.86,5.39 69.09,5.39 73.53,9.84 73.53,19.11 74.42,20 87.5,20 90.55,23.05 90.55,29.52 U5.5
$1N15633: length 66.4
  Bottom Layer w0.254: 44.58,14.16 34.8,14.16 ESP32B.10 ; 44.58,14.16 44.7,14.16 ; 44.58,14.16 56.36,25.94 78.59,25.94 U6.5
$2N758: length 1.2
  Top Layer w0.254: C26.2 116.17,16.82 U4.4
$2N763: length 7.5
  Top Layer w0.254: C17.2 v5(110.83,21.54) ; v5(110.83,16.87) 110.87,16.83 U4.1
  Bottom Layer w0.254: v5(110.83,16.87) v5(110.83,21.54)
$2N764: length 4
  Top Layer w0.254: C18.2 114.89,24.55 114.96,24.49 114.89,24.42 U4.6
$2N769: length 9.7
  Top Layer w0.254: 116.97,10.26 116.97,13.65 114.89,15.73 U4.3 ; 116.97,10.26 R13.2 ; 116.97,10.26 R12.1
$2N774: length 1.4
  Top Layer w0.254: R8.2 114.89,28.66 C18.1
$2N775: length 1.4
  Top Layer w0.254: R9.1 R10.2
$2N777: length 4.2
  Top Layer w0.254: R10.1 116.42,24.49 R11.2 116.16,24.22 U4.5

## Copper pours and planes (outline as drawn; the poured copper is in the pictures)
GND on Top Layer: 118.7,9.37 119.84,9.37 119.84,28.17 117.56,28.17 117.56,20.8 100.8,20.8 100.8,9.37 112.1,9.37 112.1,15.85 109.81,15.85 109.81,18.26 118.7,18.26
GND on Top Layer: 113.11,20.55 113.11,29.68 114.13,29.68 114.13,20.55
GND on Bottom Layer: -0.64,36.64 129.79,36.64 129.79,-0.45 -0.64,-0.45
VCC on Top Layer: 100.8,21.31 105.24,21.31 105.24,29.69 100.8,29.69
VIN on Top Layer: 112.99,9.35 112.99,18.01 114.26,18.01 114.26,9.35
PH on Top Layer: 111.87,21.03 112.73,21.03 112.73,29.7 105.75,29.7 105.75,21.31 109.68,21.31 109.68,23.09 111.86,23.09

## Text on the board
Top Silkscreen Layer: GPIO27 | GND | VCC | GPIO4 | GPIO5 | GPIO18 | - | MPU6050 | + | U1 | U0
